# Altium project Prj_uinv-rev-b.PrjPcb
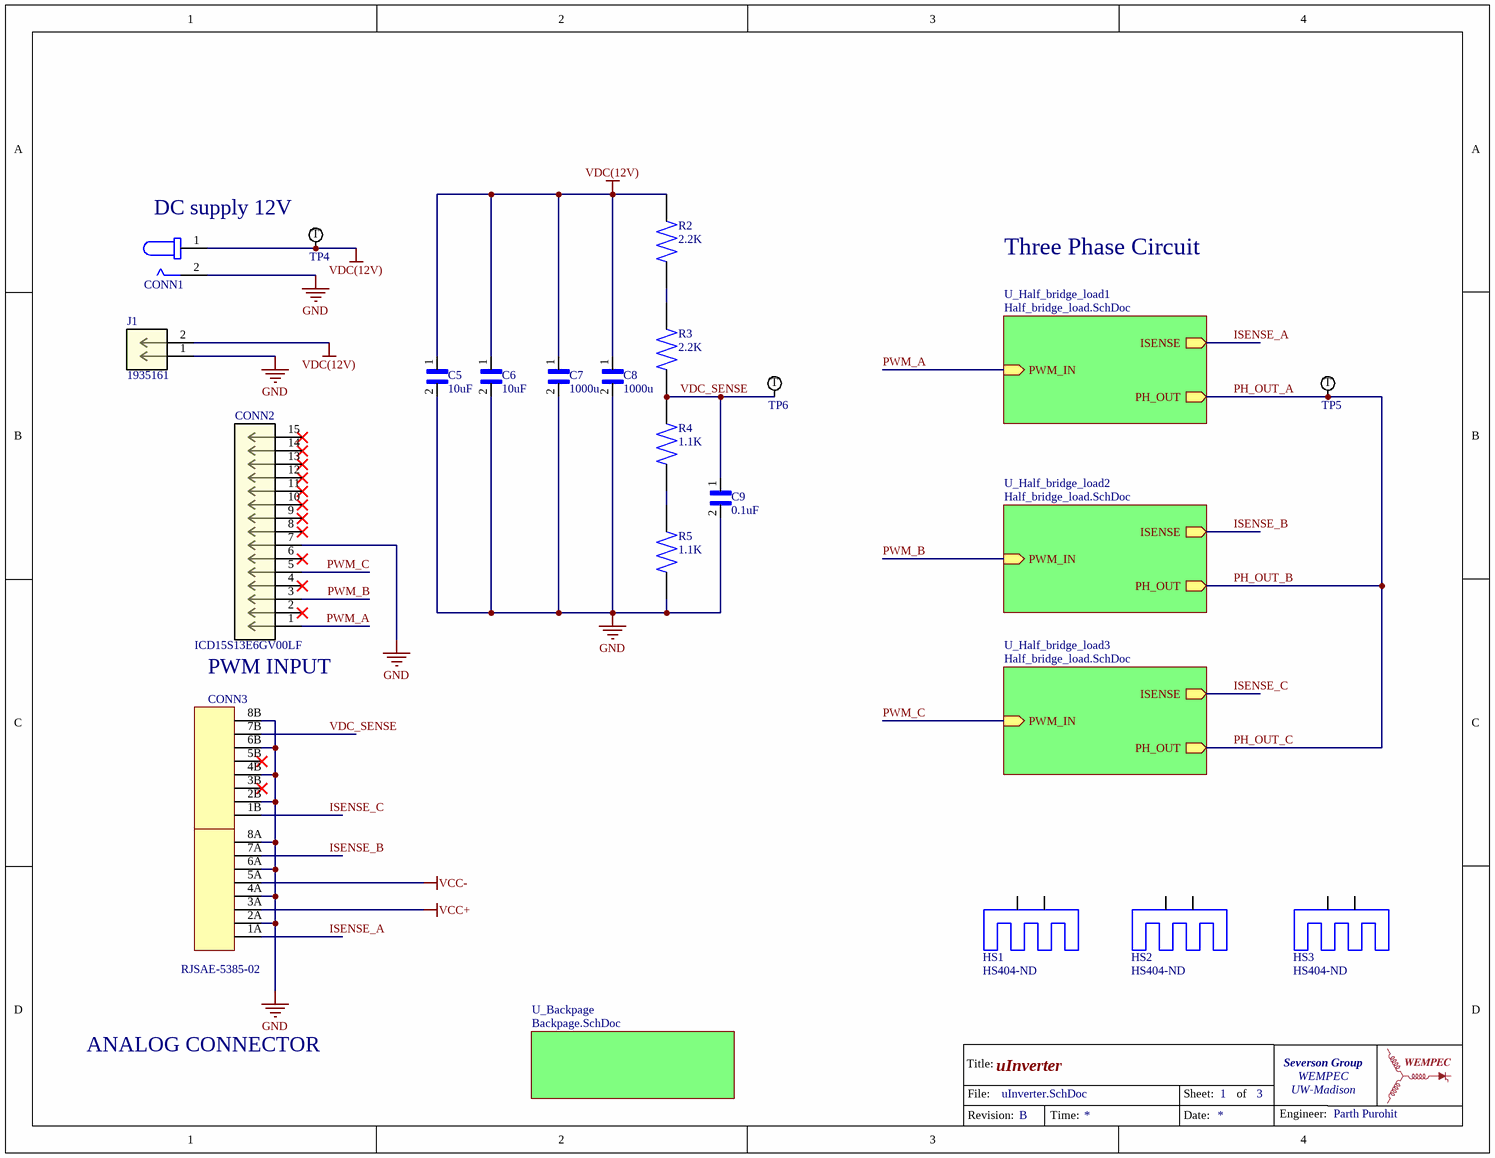
[diagram p0: uInverter.SchDoc]
ProjectGroup: Severson Group; ProjectOrganization: WEMPEC; ProjectRev: B; ProjectUniversity: UW-Madison
3 sheets, 99 parts. Net scope: hierarchical (ports join the sheet entries above them; power ports are global).
Board file: PCB1_uinv_rev_B.PcbDoc
Sheets:
  uInverter.SchDoc
    U_Half_bridge_load1 = Half_bridge_load.SchDoc
    U_Half_bridge_load2 = Half_bridge_load.SchDoc
    U_Half_bridge_load3 = Half_bridge_load.SchDoc
    U_Backpage = Backpage.SchDoc

## Sheet uInverter.SchDoc: uInverter
size Letter; Engineer: Parth Purohit; Revision: B; SheetNumber: 1; SheetTotal: 3

### Parts
C5  10uF  [0805_CAP]
C6  10uF  [0805_CAP]
C7  1000u  [CAP_PAN_12.5X25_PAN]
C8  1000u  [CAP_PAN_12.5X25_PAN]
C9  0.1uF  [0805_CAP]
CONN1  PJ-037AH  [CUI_PJ-037AH]  (value not drawn)
CONN2  ICD15S13E6GV00LF  [ICD15S13E6GV00LF]
CONN3  RJSAE-5385-02  [CONN_RJSAE538502_AMP]
HS1  Supplier Part Number 1: HS404-ND  [530002]  (hidden comment: 529702B02500G)
HS2  Supplier Part Number 1: HS404-ND  [530002]  (hidden comment: 529702B02500G)
HS3  Supplier Part Number 1: HS404-ND  [530002]  (hidden comment: 529702B02500G)
J1  1935161  [PHOENIX_1935161]
R2  2.2K  [0805_RES]
R3  2.2K  [0805_RES]
R4  1.1K  [0805_RES]
R5  1.1K  [0805_RES]
TitleBlockWEMPEC1  TitleBlockWEMPEC  (value not drawn)  (graphical)
TP4  Test Point  [TP_1.6MM]  (value not drawn)
TP5  Test Point  [TP_1.6MM]  (value not drawn)
TP6  Test Point  [TP_1.6MM]  (value not drawn)

### Sub-sheets
U_Backpage = Backpage.SchDoc: no entries
U_Half_bridge_load1 = Half_bridge_load.SchDoc: ISENSE (out), PWM_IN (in), PH_OUT (out)
U_Half_bridge_load2 = Half_bridge_load.SchDoc: ISENSE (out), PWM_IN (in), PH_OUT (out)
U_Half_bridge_load3 = Half_bridge_load.SchDoc: ISENSE (out), PWM_IN (in), PH_OUT (out)

### Nets
GND: C5.2 C6.2 C7.2 C8.2 C9.2 CONN1.2 CONN2.7 CONN3.2A CONN3.2B CONN3.4A CONN3.4B CONN3.6A CONN3.6B CONN3.8A CONN3.8B J1.1 R5.1
VCC+: CONN3.3A
VCC-: CONN3.5A
VDC(12V): C5.1 C6.1 C7.1 C8.1 CONN1.1 J1.2 R2.2 TP4.1
ISENSE_A: CONN3.1A ; sheet U_Half_bridge_load1/ISENSE
ISENSE_B: CONN3.7A ; sheet U_Half_bridge_load2/ISENSE
ISENSE_C: CONN3.1B ; sheet U_Half_bridge_load3/ISENSE
PH_OUT_A: TP5.1 ; sheet U_Half_bridge_load1/PH_OUT, sheet U_Half_bridge_load2/PH_OUT, sheet U_Half_bridge_load3/PH_OUT  [also labelled PH_OUT_B, PH_OUT_C]
PWM_A: CONN2.1 ; sheet U_Half_bridge_load1/PWM_IN
PWM_B: CONN2.3 ; sheet U_Half_bridge_load2/PWM_IN
PWM_C: CONN2.5 ; sheet U_Half_bridge_load3/PWM_IN
VDC_SENSE: C9.1 CONN3.7B R3.1 R4.2 TP6.1
NetR2_1: R2.1 R3.2
NetR4_1: R4.1 R5.2

Not connected (* = marked no-connect by the designer): CONN2 2* 4* 6* 8* 9* 10* 11* 12* 13* 14* 15*; CONN3 3B(79)* 5B(79)*; HS1 P$1(1) P$2(2); HS2 P$1(1) P$2(2); HS3 P$1(1) P$2(2)

### Notes on the sheet
- DC supply 12V
- Three Phase Circuit
- PWM INPUT
- ANALOG CONNECTOR
- (in symbol Test Point 36-5005ND) T
- (in symbol TitleBlockWEMPEC) Title:; File:; Sheet:; of; Engineer:; Revision:; Time:; Date:

### Library data of the parts
C5 C6 = GRM21BR6YA106KE43L: 0805 35 V 10 uF ±10% Tolerance X5R Multilayer Ceramic Capacitor; Manufacturer: Murata; Voltage Rating: 35V; Supplier 1: Digi-Key; Manufacturer Part Number: GRM21BR6YA106KE43L; RoHS: Yes; Category: Ceramic Capacitors; Stock 1: 12398; Pricing 1: 3000=0.12929, 6000=0.12211, 9000=0.11493, 15000=0.11134, 30000=0.10775, 75000=0.10056 (USD); Mount: Surface Mount; Case/Package: 0805; Case Code (Metric): 2012; Case Code (Imperial): 0805; Weight: 0.000335oz; Min Operating Temperature: -55°C; Max Operating Temperature: 85°C; Value: 10uF; Packaging: Tape and Reel; Dielectric: X5R; Tolerance: 10%; Termination: SMD/SMT; Voltage Rating (DC): 35V; Package Quantity: 3000; Length: 0.079inch; Width: 0.049inch; Height: 1.25mm; Thickness: 0.057inch; REACH SVHC: No SVHC; Lead Free: Lead Free; RoHS Compliant: Yes; ComponentLink1URL: http://www.farnell.com/datasheets/2079187.pdf?src-supplier=Farnell; ComponentLink1Description: http://www.farnell.com/datasheets/2079187.pdf?src-supplier=Farnell; ComponentLink2URL: http://www.mouser.com/ds/2/281/c02e-2905.pdf?src-supplier=Mouser; ComponentLink2Description: http://www.mouser.com/ds/2/281/c02e-2905.pdf?src-supplier=Mouser; ComponentLink3URL: http://www.farnell.com/datasheets/2079187.pdf?src-supplier=Element14; ComponentLink3Description: http://www.farnell.com/datasheets/2079187.pdf?src-supplier=Element14; ComponentLink4URL: http://search.murata.co.jp/Ceramy/image/img/A01X/G101/ENG/GRM21BR6YA106KE43-01.pdf?src-supplier=Digi-Key; ComponentLink4Description: http://search.murata.co.jp/Ceramy/image/img/A01X/G101/ENG/GRM21BR6YA106KE43-01.pdf?src-supplier=Digi-Key; ComponentLink5URL: http://search.murata.co.jp/Ceramy/image/img/A01X/partnumbering_e_01.pdf?src-supplier=Digi-Key; ComponentLink5Description: http://search.murata.co.jp/Ceramy/image/img/A01X/partnumbering_e_01.pdf?src-supplier=Digi-Key; ComponentLink6URL: http://www.farnell.com/datasheets/2079187.pdf?src-supplier=Newark; ComponentLink6Description: http://www.farnell.com/datasheets/2079187.pdf?src-supplier=Newark; Supplier Part Number 1: 490-10514-2-ND
C7 C8 = EEU-FM1V102B: Cap Aluminum 1000uF 35V 20% (12.5 X 25mm) Radial 5mm 3190mA 7000 hr 105C Ammo Pack; Manufacturer: Panasonic; Value: 1mF; Ripple Current: 3.19A; Life (Hours): 7000Hour; Impedance: 15mR; Polarity: Polar; Lead Diameter: 0.6mm; Supplier 1: Digi-Key; Manufacturer Part Number: EEU-FM1V102B; RoHS: Yes; Category: Aluminum Electrolytic Capacitors; Stock 1: 691; Pricing 1: 1=1.11000, 10=0.84300, 50=0.70060, 100=0.60330 (USD); Mount: Through Hole; Case/Package: Radial; Min Operating Temperature: -40°C; Max Operating Temperature: 105°C; Tolerance: 20%; Termination: Radial; Voltage Rating: 35V; Packaging: Tape and Reel; Package Quantity: 500; Voltage Rating (DC): 35V; ESR (Equivalent Series Resistance): 15mR; Series: FM; Construction: RADIAL; Diameter: 12mm; Length: 25mm; Height: 25mm; Lead Pitch: 5mm; Height - Seated (Max): 1.063inch; Radiation Hardening: No; Lead Free: Lead Free; RoHS Compliant: Yes; ComponentLink1URL: https://datasheet.ciiva.com/11676/aba0000ce108-11676917.pdf?src-supplier=Avnet; ComponentLink1Description: https://datasheet.ciiva.com/11676/aba0000ce108-11676917.pdf?src-supplier=Avnet; Supplier Part Number 1: P19719CT-ND
C9 = CC0805KRX7R7BB104: Capacitor 0.1uF 16V 0805 SMD X7R; Manufacturer: Yageo; Value: 100nF; Tolerance: 10%; Insulation Resistance: 100GR; Supplier 1: Digi-Key; Manufacturer Part Number: CC0805KRX7R7BB104; RoHS: Yes; Category: Ceramic Capacitors; Stock 1: 1440; Pricing 1: 1=0.12000, 10=0.08400, 50=0.04760, 100=0.03950, 500=0.02768, 1000=0.02291 (USD); Mount: Surface Mount; Case/Package: 0805; Number of Pins: 2; Case Code (Metric): 2012; Case Code (Imperial): 0805; Min Operating Temperature: -55°C; Max Operating Temperature: 125°C; Dielectric: X7R; Voltage Rating: 16V; Voltage Rating (DC): 16V; Packaging: Tape and Reel; Package Quantity: 1; Termination: SMD/SMT; Resistor Type: Ceramic; Voltage: 16V; Series: CC; Length: 2mm; Width: 0.049inch; Height: 0.85mm; Depth: 1.25mm; Thickness: 0.033inch; Radiation Hardening: No; RoHS Compliant: Yes; REACH SVHC: No SVHC; Lead Free: Lead Free; Halogen Free: Halogen Free; ComponentLink1URL: https://datasheet.ciiva.com/11786/0900766b80d84f1d-11786102.pdf?src-supplier=RSComponents; ComponentLink1Description: https://datasheet.ciiva.com/11786/0900766b80d84f1d-11786102.pdf?src-supplier=RSComponents; ComponentLink2URL: https://datasheet.ciiva.com/8034/1784427-8034017.pdf?src-supplier=Element14; ComponentLink2Description: https://datasheet.ciiva.com/8034/1784427-8034017.pdf?src-supplier=Element14; ComponentLink3URL: https://datasheet.ciiva.com/144/mlccorderingcode-144998.pdf?src-supplier=Digi-Key; ComponentLink3Description: https://datasheet.ciiva.com/144/mlccorderingcode-144998.pdf?src-supplier=Digi-Key; ComponentLink4URL: https://datasheet.ciiva.com/144/mlccorderingcode-144999.pdf?src-supplier=Digi-Key; ComponentLink4Description: https://datasheet.ciiva.com/144/mlccorderingcode-144999.pdf?src-supplier=Digi-Key; ComponentLink5URL: https://datasheet.ciiva.com/145/mlccorderingcode-145000.pdf?src-supplier=Digi-Key; ComponentLink5Description: https://datasheet.ciiva.com/145/mlccorderingcode-145000.pdf?src-supplier=Digi-Key; ComponentLink6URL: https://datasheet.ciiva.com/11465/upy-gphc-x7r-6-3v-to-50v-8-11465289.pdf?src-supplier=Avnet; ComponentLink6Description: https://datasheet.ciiva.com/11465/upy-gphc-x7r-6-3v-to-50v-8-11465289.pdf?src-supplier=Avnet; ComponentLink7URL: https://datasheet.ciiva.com/17436/upy-gphc-x7r-6-3v-to-50v-8-17436617.pdf?src-supplier=Avnet+Europe; ComponentLink7Description: https://datasheet.ciiva.com/17436/upy-gphc-x7r-6-3v-to-50v-8-17436617.pdf?src-supplier=Avnet+Europe; ComponentLink8URL: https://datasheet.ciiva.com/8034/1784427-8034015.pdf?src-supplier=Element14; ComponentLink8Description: https://datasheet.ciiva.com/8034/1784427-8034015.pdf?src-supplier=Element14; ComponentLink9URL: https://datasheet.ciiva.com/15189/getdatasheetpartid-314877-15189221.pdf?src-supplier=Verical; ComponentLink9Description: https://datasheet.ciiva.com/15189/getdatasheetpartid-314877-15189221.pdf?src-supplier=Verical; ComponentLink10URL: https://datasheet.ciiva.com/7978/1489800-7978204.pdf?src-supplier=Element14; ComponentLink10Description: https://datasheet.ciiva.com/7978/1489800-7978204.pdf?src-supplier=Element14; Supplier Part Number 1: 311-1142-1-ND
CONN1 = PJ-037AH: CONN PWR JACK 2X5.5MM SOLDER; Manufacturer: CUI; Shielding: Unshielded; Gender: Male; Current Rating: 5A; Number of Conductors: 2; Voltage Rating: 24V; Insulation Resistance: 100MR; Supplier 1: Digi-Key; Manufacturer Part Number: PJ-037AH; RoHS: Yes; Category: Connectors; Stock 1: 11304; Pricing 1: 1=0.71000, 10=0.66600, 25=0.59920, 50=0.53280, 100=0.51060, 250=0.46620, 500=0.44400, 1000=0.36630, 2500=0.33300 (USD); Mount: Through Hole; Color: Black; Contact Material: Copper; Contact Plating: Nickel; Housing Color: Black; Housing Material: Thermoplastic; Min Operating Temperature: -25°C; Max Operating Temperature: 85°C; Connector Type: Jack; Termination: Solder; Package Quantity: 500; Contact Gender: Male; Orientation: Horizontal; Series: -; Flammability Rating: UL94 V-0; Lead Free: Lead Free; RoHS Compliant: Yes; ComponentLink1URL: http://www.mouser.com/ds/2/670/pj-037ah-516064.pdf?src-supplier=Mouser; ComponentLink1Description: http://www.mouser.com/ds/2/670/pj-037ah-516064.pdf?src-supplier=Mouser; ComponentLink2URL: https://www.cui.com/product/resource/digikeypdf/pj-037ah.pdf?src-supplier=Digi-Key; ComponentLink2Description: https://www.cui.com/product/resource/digikeypdf/pj-037ah.pdf?src-supplier=Digi-Key; Supplier Part Number 1: CP-037AH-ND
CONN2 = ICD15S13E6GV00LF: Conn High Density D-Sub SKT 15 POS 2.28mm Solder RA Thru-Hole 15 Terminal 1 Port; Manufacturer: Amphenol FCI; Plating: Bright,Tin,Steel,Chrome; Body Material: Metal,Steel; Number of Terminals/Pins: 15; Mating Cycles: 500; Voltage Rating: 300V; Current Rating: 3A; Gender: Female; Connector Type: D-Sub,Receptacle,Signal; Number of Ports: 1; Supplier 1: Digi-Key; Manufacturer Part Number: ICD15S13E6GV00LF; RoHS: Yes; Category: D-Sub Connectors; Stock 1: 3485; Pricing 1: 1=2.28000, 10=2.06800, 25=1.94120, 50=1.85680, 100=1.77230, 250=1.60352, 500=1.47692, 1000=1.26593, 2500=1.18154 (USD); Mount: Through Hole; Case/Package: Metal; Color: Black; Contact Plating: Gold,Tin,Matte; Contact Material: Copper Alloy; Housing Color: Black; Housing Material: Steel; Min Operating Temperature: -55°C; Max Operating Temperature: 125°C; Packaging: Bulk; Package Quantity: 100; Number of Rows: 3; Max Voltage Rating (AC): 300V; Number of Positions: 15; Termination: Solder; Number of Contacts: 15; Max Supply Voltage (AC): 300V; Orientation: Right Angle; Length: 30.81mm; Width: 12.58mm; Pitch: 2.28mm; Depth: 21.7mm; Radiation Hardening: No; REACH SVHC: No SVHC; Lead Free: Lead Free; Flammability Rating: UL94 V-0; ComponentLink1URL: https://datasheet.ciiva.com/22727/1728476-22727809.pdf?src-supplier=Element14; ComponentLink1Description: https://datasheet.ciiva.com/22727/1728476-22727809.pdf?src-supplier=Element14; ComponentLink2URL: https://datasheet.ciiva.com/652/c-cd-0011-652471.pdf?src-supplier=Digi-Key; ComponentLink2Description: https://datasheet.ciiva.com/652/c-cd-0011-652471.pdf?src-supplier=Digi-Key; ComponentLink3URL: https://datasheet.ciiva.com/8058/1728476-8058812.pdf?src-supplier=Element14; ComponentLink3Description: https://datasheet.ciiva.com/8058/1728476-8058812.pdf?src-supplier=Element14; Supplier Part Number 1: 609-2802-ND
CONN3 = RJSAE-5385-02: CONN MOD JACK 8P8C R/A SHIELDED; Manufacturer: Amphenol Commercial; Number of Contacts: 16; Gender: Female; Current Rating: 1.5A; Voltage Rating: 125V; Number of Ports: 2; Direction: Up and Down; Pitch: 2.54mm; Supplier 1: Digi-Key; Manufacturer Part Number: RJSAE-5385-02; RoHS: Yes; Category: Modular / Ethernet Connectors; Stock 1: 254; Pricing 1: 1=6.67000, 10=6.39000, 25=5.83440, 50=5.55660, 100=5.27880, 250=4.72312, 500=4.44528, 1000=4.01310 (USD); Mount: Through Hole; Color: Black,Green; Contact Plating: Gold; Contact Material: Bronze; Housing Material: Thermoplastic; Min Operating Temperature: -55°C; Max Operating Temperature: 85°C; Termination: Solder; Orientation: Right Angle; Package Quantity: 35; Packaging: Tray; Shielding: Shielded; Number of Rows: 2; Number of Positions Loaded: 16; Connector Type: Jack; Series: RJSAE; Length: 16.51mm; Depth: 28.15mm; Radiation Hardening: No; Lead Free: Lead Free; RoHS Compliant: Yes; ComponentLink1URL: https://datasheet.ciiva.com/26934/getdatasheetpartid-29521-26934348.pdf?src-supplier=Verical; ComponentLink1Description: https://datasheet.ciiva.com/26934/getdatasheetpartid-29521-26934348.pdf?src-supplier=Verical; Supplier Part Number 1: RJSAE-5385-02-ND
HS1-HS3 = 529702B02500G: Heat Sink Passive TO-220 Radial Thru-Hole 2.6C/W Black Anodized; MP: 530002B02500G; MF: Aavid Thermalloy; Shape: Fins,Rectangular; Thermal Resistance @ Forced Air Flow (100 LFM): 2°C/W; Natural Thermal Resistance: 2.6°C/W; Package: None; SnapEDA_Link: https://www.snapeda.com/parts/530002B02500G/Aavid%20Thermalloy/view-part/4792019/?ref=snap; Availability: Unavailable; Value: *; Price: None; Manufacturer: Aavid Thermalloy; Manufacturer Part Number: 529702B02500G; RoHS: Yes; Category: Heat Sinks; Stock 1: 1035; Pricing 1: 1=6.14000, 10=5.97200, 25=5.64040, 50=5.30860, 100=4.97680, 250=4.64500, 500=4.31320, 1000=4.23026 (USD); Mount: Bolt,PC Pin,Solder; Case/Package: Radial; Color: Black; Package Cooled: TO-220; Material: Aluminium,Anodized; Finish: Anodized; Type: Passive; Package Quantity: 200; Series: 5300; Length: 41.91mm; Width: 1.65inch; Height: 63.5mm; Depth: 25.4mm; Height Off Base: 1inch; Radiation Hardening: No; REACH SVHC: Unknown; Lead Free: Lead Free; RoHS Compliant: Yes; ComponentLink1URL: https://datasheet.ciiva.com/15182/getdatasheetpartid-311919-15182633.pdf?src-supplier=Verical; ComponentLink1Description: https://datasheet.ciiva.com/15182/getdatasheetpartid-311919-15182633.pdf?src-supplier=Verical; ComponentLink2URL: https://datasheet.ciiva.com/22641/1699368-22641984.pdf?src-supplier=Element14; ComponentLink2Description: https://datasheet.ciiva.com/22641/1699368-22641984.pdf?src-supplier=Element14; ComponentLink3URL: https://datasheet.ciiva.com/19457/696626-19457620.pdf?src-supplier=Jameco; ComponentLink3Description: https://datasheet.ciiva.com/19457/696626-19457620.pdf?src-supplier=Jameco; ComponentLink4URL: https://datasheet.ciiva.com/6333/aavid-board-level-heatsinks-catalog-6333980.pdf?src-supplier=Digi-Key; ComponentLink4Description: https://datasheet.ciiva.com/6333/aavid-board-level-heatsinks-catalog-6333980.pdf?src-supplier=Digi-Key; ComponentLink5URL: https://datasheet.ciiva.com/14543/70115166-14543413.pdf?src-supplier=Allied+Electronics; ComponentLink5Description: https://datasheet.ciiva.com/14543/70115166-14543413.pdf?src-supplier=Allied+Electronics; Supplier 1: Digi-Key
J1 = 1935161: Conn Terminal Blocks 2 POS 5mm Solder ST Thru-Hole 16A; Manufacturer: Phoenix Contact; Max Supply Voltage: 250V; Current Rating: 17.5A; Number of Poles: 2; Number of Levels: 1; Current: 18A; Voltage: 300V; Voltage Rating (DC): 320V; Connector Type: Screw; Wire Gauge (Max): 26AWG; Wire Gauge (Min): 12AWG; Approvals: UL; Supplier 1: Digi-Key; Manufacturer Part Number: 1935161; RoHS: Yes; Category: Terminal Blocks; Stock 1: 82071; Pricing 1: 1=0.43000, 10=0.41400, 50=0.39600, 100=0.38520, 250=0.36000, 500=0.33120, 1000=0.30600 (USD); Mount: Through Hole; Number of Pins: 2; Color: Green; Weight: 0.067021oz; Material: Nylon; Housing Color: Green; Housing Material: Polyamide; Insulation Material: Nylon; Contact Material: Copper,Tin; Number of Rows: 1; Max Current Rating: 16A; Voltage Rating: 250V; Package Quantity: 250; Packaging: Bulk; Number of Positions: 2; Number of Positions Per Level: 2; Termination: Solder; Number of Contacts: 2; Number of Circuits: 2; Orientation: Straight; Series: COMBICON PT; Number of Ways: 2; Length: 9mm; Width: 14.9mm; Height: 11.3mm; Pitch: 5mm; Depth: 9mm; Wire/Cable Gauge: 26AWG; Radiation Hardening: No; Lead Free: Lead Free; Flammability Rating: UL94 V-0; REACH SVHC: Unknown; RoHS Compliant: Yes; ComponentLink1URL: https://datasheet.ciiva.com/15169/getdatasheetpartid-177903-15169663.pdf?src-supplier=Verical; ComponentLink1Description: https://datasheet.ciiva.com/15169/getdatasheetpartid-177903-15169663.pdf?src-supplier=Verical; ComponentLink2URL: https://datasheet.ciiva.com/16047/1935161-16047247.pdf?src-supplier=Onlinecomponents.com; ComponentLink2Description: https://datasheet.ciiva.com/16047/1935161-16047247.pdf?src-supplier=Onlinecomponents.com; ComponentLink3URL: https://datasheet.ciiva.com/824/combiconcompact5-0mmseries-824222.pdf?src-supplier=Digi-Key; ComponentLink3Description: https://datasheet.ciiva.com/824/combiconcompact5-0mmseries-824222.pdf?src-supplier=Digi-Key; Supplier Part Number 1: 277-1667-ND
R2 R3 = RCS08052K20FKEA: Res Thick Film 0805 2.2K Ohm 1% 0.4W; Manufacturer: Vishay Dale; Value: 2.2kR; Max Power Dissipation: 400mW; Temperature Coefficient: 100ppm/°C; Supplier 1: Digi-Key; Manufacturer Part Number: RCS08052K20FKEA; RoHS: Yes; Category: Chip SMD Resistors; Stock 1: 5528; Pricing 1: 1=0.26000, 10=0.21800, 100=0.08510, 1000=0.03560, 2500=0.03264 (USD); Case/Package: 0805; Case Code (Metric): 2012; Case Code (Imperial): 0805; Min Operating Temperature: -55°C; Max Operating Temperature: 155°C; Packaging: Cut Tape; Resistor Type: Thick Film; Number of Terminations: 2; Tolerance: 1%; Features: Automotive AEC-Q200; Length: 0.079inch; Width: 0.049inch; Height: 0.02inch; ComponentLink1URL: http://www.vishay.com/docs/20065/rcse3.pdf?src-supplier=Digi-Key; ComponentLink1Description: http://www.vishay.com/docs/20065/rcse3.pdf?src-supplier=Digi-Key; Supplier Part Number 1: 541-2841-1-ND
R4 R5 = ESR10EZPF1101: Res Thick Film 0805 1.1K Ohm 1% 0.4W; Manufacturer: Rohm; Value: 1.1kR; Temperature Coefficient: 100ppm/°C; Power Rating: 400mW; Supplier 1: Digi-Key; Manufacturer Part Number: ESR10EZPF1101; RoHS: Yes; Category: Chip SMD Resistors; Stock 1: 6361; Pricing 1: 1=0.18000, 10=0.15300, 100=0.05980, 1000=0.02505, 2500=0.02296 (USD); Case/Package: 0805; Case Code (Metric): 2012; Case Code (Imperial): 0805; Size Code: 0805; Min Operating Temperature: -55°C; Max Operating Temperature: 155°C; Tolerance: 1%; Packaging: Tape and Reel; Resistor Type: Thick Film; Package Quantity: 1; Number of Terminations: 2; Max Power Dissipation: 400mW; Features: Automotive AEC-Q200; Series: ESR; Length: 0.079inch; Width: 0.049inch; Height: 0.026inch; Lead Free: Lead Free; RoHS Compliant: Yes; ComponentLink1URL: https://datasheet.ciiva.com/2470/esr-2470093.pdf?src-supplier=Digi-Key; ComponentLink1Description: https://datasheet.ciiva.com/2470/esr-2470093.pdf?src-supplier=Digi-Key; ComponentLink2URL: https://datasheet.ciiva.com/2470/esr-2470094.pdf?src-supplier=Digi-Key; ComponentLink2Description: https://datasheet.ciiva.com/2470/esr-2470094.pdf?src-supplier=Digi-Key; ComponentLink3URL: https://datasheet.ciiva.com/2470/esr-2470095.pdf?src-supplier=Digi-Key; ComponentLink3Description: https://datasheet.ciiva.com/2470/esr-2470095.pdf?src-supplier=Digi-Key; ComponentLink4URL: https://datasheet.ciiva.com/16212/esr10ezpd-16212063.pdf?src-supplier=Future+Electronics; ComponentLink4Description: https://datasheet.ciiva.com/16212/esr10ezpd-16212063.pdf?src-supplier=Future+Electronics; Supplier Part Number 1: RHM1.10KAECT-ND
TP4-TP6 = Test Point 36-5005ND: Conn Test Point SKT 1 POS ST Thru-Hole 1 Port; Manufacturer: Keystone Electronics; Manufacturer Part Number: 5005; Material - Insulation: No Insulation; Body Material: PBT; Number of Ports: 1; Inside Diameter: 1.78mm; Outside Diameter: 3.18mm; Hole Diameter: 1.6mm; Supplier Part Number: 36-5005-ND; Supplier: Digi-Key; Footprint: *; RoHS: RoHS Compliant; Category: Test and Measurement; Stock 1: 136646; Pricing 1: 1=0.22, 10=0.206, 25=0.1756, 50=0.1536, 100=0.1426, 250=0.12616, 500=0.12068, 1000=0.09874 (USD); Packaging: Cut Tape (CT); Part Status: Active; Type: PC Test Point; Mounting Type: Surface Mount; Color: Natural; Size / Dimension: 0.063" x 0.031" x 0.045" (1.60mm x 0.80mm x 1.15mm); Plating: -; Material - Body: -; ComponentLink1URL: http://www.te.com/commerce/DocumentDelivery/DDEController?Action=srchrtrv&DocNm=1773266&DocType=DS&DocLang=English; ComponentLink1Description: http://www.te.com/commerce/DocumentDelivery/DDEController?Action=srchrtrv&DocNm=1773266&DocType=DS&DocLang=English; Stock 2: 147226; Pricing 2: 1=0.42000, 25=0.34080, 100=0.30150, 250=0.28304, 500=0.25230, 1000=0.19884, 2500=0.18180, 5000=0.17044 (USD); Mount: PCB,Through Hole; Contact Material: Bronze; Contact Plating: Silver,Tin; Material: Nylon,Bronze,Silver; Housing Color: Red; Termination: Solder; Orientation: Straight; Series: THM; Package Quantity: 100; Length: 8.89mm; Height: 0.35inch; Lead Free: Lead Free; REACH SVHC: No SVHC; Flammability Rating: UL94 V-0; RoHS Compliant: Yes; ComponentLink2URL: https://datasheet.ciiva.com/11744/0900766b8009b7c7-11744948.pdf?src-supplier=RSComponents; ComponentLink2Description: https://datasheet.ciiva.com/11744/0900766b8009b7c7-11744948.pdf?src-supplier=RSComponents; ComponentLink3URL: https://datasheet.ciiva.com/2917/m60-2p60-2917633.pdf?src-supplier=Digi-Key; ComponentLink3Description: https://datasheet.ciiva.com/2917/m60-2p60-2917633.pdf?src-supplier=Digi-Key; ComponentLink4URL: https://datasheet.ciiva.com/16508/m60-2p60-16508073.pdf?src-supplier=Future+Electronics; ComponentLink4Description: https://datasheet.ciiva.com/16508/m60-2p60-16508073.pdf?src-supplier=Future+Electronics; ComponentLink5URL: https://datasheet.ciiva.com/1454/1703983-1454828.pdf?src-supplier=Element14; ComponentLink5Description: https://datasheet.ciiva.com/1454/1703983-1454828.pdf?src-supplier=Element14; ComponentLink6URL: https://datasheet.ciiva.com/16883/70182825-16883781.pdf?src-supplier=Allied+Electronics; ComponentLink6Description: https://datasheet.ciiva.com/16883/70182825-16883781.pdf?src-supplier=Allied+Electronics; Supplier 1: Digi-Key; Supplier Part Number 1: 36-5005-ND

## Sheet Half_bridge_load.SchDoc: Half Bridge and Load
size Letter; Engineer: Parth Purohit; Revision: B; SheetNumber: 2; SheetTotal: 3
Used 3 times, as channels U_Half_bridge_load1, U_Half_bridge_load2, U_Half_bridge_load3. Parts and nets are listed once, with the designators drawn on the sheet.
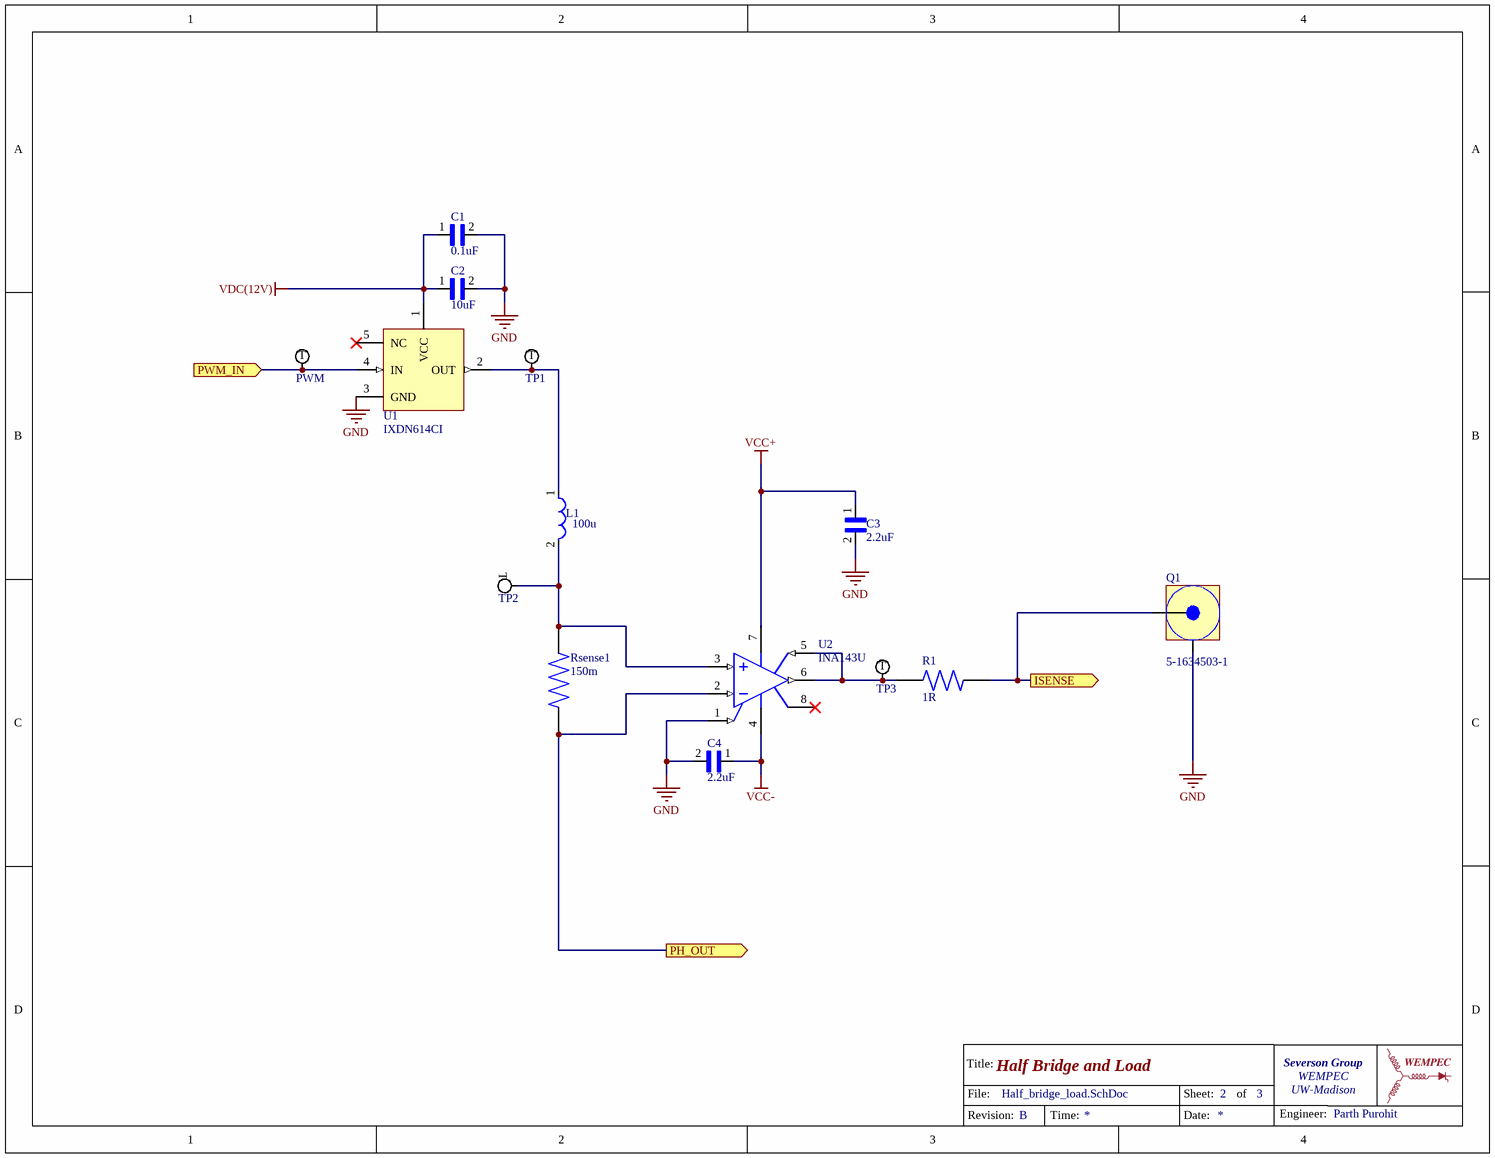
[diagram p1: Half_bridge_load.SchDoc]

### Parts
C1  0.1uF  [0805_CAP]
C2  10uF  [0805_CAP]
C3  2.2uF  [0805_CAP]
C4  2.2uF  [0805_CAP]
L1  100u  [FP-PA4344_104NLT-MFG]
PWM  Test Point  [TP_1.6MM]  (value not drawn)
Q1  5-1634503-1  [5-1634503-1]
R1  1R  [0805_RES]
Rsense1  150m  [RES_15_OHM]
TitleBlockWEMPEC2  TitleBlockWEMPEC  (value not drawn)  (graphical)
TP1  Test Point  [TP_1.6MM]  (value not drawn)
TP2  Test Point  [TP_1.6MM]  (value not drawn)
TP3  Test Point  [TP_1.6MM]  (value not drawn)
U1  IXDN614CI  [IXYS_TO-220-5_IXY]
U2  INA143U  [SOIC127P599X175-8N]

### Ports
ISENSE (out), PH_OUT (out), PWM_IN (in)

### Nets
GND: C1.2 C2.2 C3.2 C4.2 Q1.2 U1.3(GND) U2.1(REF)
VCC+: C3.1 U2.7(V+)
VCC-: C4.1 U2.4(V-)
VDC(12V): C1.1 C2.1 U1.1(VCC)
ISENSE: Q1.1 R1.2 ; port ISENSE
PH_OUT: Rsense1.2 U2.2(IN-) ; port PH_OUT
PWM_IN: PWM.1 U1.4(IN) ; port PWM_IN
NetL1_1: L1.1 TP1.1 U1.2(OUT)
NetL1_2: L1.2 Rsense1.1 TP2.1 U2.3(IN+)
NetR1_1: R1.1 TP3.1 U2.5(SENSE) U2.6(OUTPUT)

Not connected (* = marked no-connect by the designer): U1 5(NC)*; U2 8(NC)*

### Channels
U_Half_bridge_load1: designators end in _U_Half_bridge_load1; ports ISENSE=ISENSE_A PH_OUT=PH_OUT_A PWM_IN=PWM_A
U_Half_bridge_load2: designators end in _U_Half_bridge_load2; ports ISENSE=ISENSE_B PH_OUT=PH_OUT_A PWM_IN=PWM_B
U_Half_bridge_load3: designators end in _U_Half_bridge_load3; ports ISENSE=ISENSE_C PH_OUT=PH_OUT_A PWM_IN=PWM_C

### Notes on the sheet
- (in symbol Test Point 36-5005ND) T
- (in symbol TitleBlockWEMPEC) Title:; File:; Sheet:; of; Engineer:; Revision:; Time:; Date:

### Library data of the parts
C1 = C0805C104K6RACTU: Cap Ceramic 0.1uF 35V X7R 10% SMD 0805; Manufacturer: KEMET; Value: 100nF; Supplier 1: Digi-Key; Manufacturer Part Number: C0805C104K6RACTU; RoHS: Yes; Category: Ceramic Capacitors; Stock 1: 8542; Pricing 1: 1=0.48000, 10=0.33000, 50=0.23100, 100=0.19800, 500=0.14850, 1000=0.12540 (USD); Mount: Surface Mount; Case/Package: 0805; Dielectric Material: Ceramic; Min Operating Temperature: -55°C; Max Operating Temperature: 125°C; Packaging: Tape and Reel; Tolerance: 10%; Dielectric: X7R; Voltage Rating (DC): 35V; Construction: Flat; Length: 2mm; Height: 0.9mm; Depth: 1.25mm; Radiation Hardening: No; RoHS Compliant: Yes; ComponentLink1URL: http://www.kemet.com/kemet/web/homepage/kechome.nsf/weben/C4DA2DA1D1C9D3C3CA2570A50016092D/$file/KEM_C1002_X7R_SMD.pdf?src-supplier=Avnet; ComponentLink1Description: http://www.kemet.com/kemet/web/homepage/kechome.nsf/weben/C4DA2DA1D1C9D3C3CA2570A50016092D/$file/KEM_C1002_X7R_SMD.pdf?src-supplier=Avnet; ComponentLink2URL: https://api.kemet.com/component-edge/download/datasheet/C0805C104K6RAC7800.pdf?src-supplier=Digi-Key; ComponentLink2Description: https://api.kemet.com/component-edge/download/datasheet/C0805C104K6RAC7800.pdf?src-supplier=Digi-Key; Supplier Part Number 1: 399-17618-1-ND
C2 = GRM21BR6YA106KE43L: as C5 on sheet uInverter; Supplier 1: Digi-Key; Manufacturer Part Number: GRM21BR6YA106KE43L; RoHS: Yes; Category: Ceramic Capacitors; Stock 1: 12398; Pricing 1: 3000=0.12929, 6000=0.12211, 9000=0.11493, 15000=0.11134, 30000=0.10775, 75000=0.10056 (USD); Mount: Surface Mount; Case/Package: 0805; Case Code (Metric): 2012; Case Code (Imperial): 0805; Weight: 0.000335oz; Min Operating Temperature: -55°C; Max Operating Temperature: 85°C; Value: 10uF; Packaging: Tape and Reel; Dielectric: X5R; Tolerance: 10%; Termination: SMD/SMT; Voltage Rating (DC): 35V; Package Quantity: 3000; Length: 0.079inch; Width: 0.049inch; Height: 1.25mm; Thickness: 0.057inch; REACH SVHC: No SVHC; Lead Free: Lead Free; RoHS Compliant: Yes; ComponentLink1URL: http://www.farnell.com/datasheets/2079187.pdf?src-supplier=Farnell; ComponentLink1Description: http://www.farnell.com/datasheets/2079187.pdf?src-supplier=Farnell; ComponentLink2URL: http://www.mouser.com/ds/2/281/c02e-2905.pdf?src-supplier=Mouser; ComponentLink2Description: http://www.mouser.com/ds/2/281/c02e-2905.pdf?src-supplier=Mouser; ComponentLink3URL: http://www.farnell.com/datasheets/2079187.pdf?src-supplier=Element14; ComponentLink3Description: http://www.farnell.com/datasheets/2079187.pdf?src-supplier=Element14; ComponentLink4URL: http://search.murata.co.jp/Ceramy/image/img/A01X/G101/ENG/GRM21BR6YA106KE43-01.pdf?src-supplier=Digi-Key; ComponentLink4Description: http://search.murata.co.jp/Ceramy/image/img/A01X/G101/ENG/GRM21BR6YA106KE43-01.pdf?src-supplier=Digi-Key; ComponentLink5URL: http://search.murata.co.jp/Ceramy/image/img/A01X/partnumbering_e_01.pdf?src-supplier=Digi-Key; ComponentLink5Description: http://search.murata.co.jp/Ceramy/image/img/A01X/partnumbering_e_01.pdf?src-supplier=Digi-Key; ComponentLink6URL: http://www.farnell.com/datasheets/2079187.pdf?src-supplier=Newark; ComponentLink6Description: http://www.farnell.com/datasheets/2079187.pdf?src-supplier=Newark; Supplier Part Number 1: 490-10514-2-ND
C3 C4 = C2012X7R1V225K125AB: 2.2 µF ±10% 35V Ceramic Capacitor X7R 0805; Manufacturer: TDK; Supplier 1: Digi-Key; Manufacturer Part Number: C2012X7R1V225K125AB; RoHS: Yes; Category: Ceramic Capacitors; Stock 1: 1992; Pricing 1: 1=0.64000, 10=0.45100, 50=0.34100, 100=0.29700, 500=0.22000, 1000=0.18700 (USD); Mount: Surface Mount; Case/Package: 0805; Case Code (Metric): 2012; Case Code (Imperial): 0805; Weight: 0.000194oz; Dielectric Material: Ceramic; Min Operating Temperature: -55°C; Max Operating Temperature: 125°C; Tolerance: 10%; Packaging: Tape and Reel; Value: 2.2uF; Package Quantity: 1; Voltage Rating: 35V; Dielectric: X7R; Termination: SMD/SMT; Voltage Rating (DC): 35V; Series: C; Construction: Flat; Length: 2mm; Width: 0.049inch; Height: 1.25mm; Thickness: 0.057inch; Depth: 1.25mm; Lead Free: Lead Free; RoHS Compliant: Yes; ComponentLink1URL: https://datasheet.ciiva.com/6286/tdkmlcccaprange-6286902.pdf?src-supplier=Digi-Key; ComponentLink1Description: https://datasheet.ciiva.com/6286/tdkmlcccaprange-6286902.pdf?src-supplier=Digi-Key; ComponentLink2URL: https://datasheet.ciiva.com/6286/tdkmlcccaprange-6286904.pdf?src-supplier=Digi-Key; ComponentLink2Description: https://datasheet.ciiva.com/6286/tdkmlcccaprange-6286904.pdf?src-supplier=Digi-Key; ComponentLink3URL: https://datasheet.ciiva.com/6286/tdkmlcccaprange-6286906.pdf?src-supplier=Digi-Key; ComponentLink3Description: https://datasheet.ciiva.com/6286/tdkmlcccaprange-6286906.pdf?src-supplier=Digi-Key; Supplier Part Number 1: 445-7551-1-ND
L1 = PA4344.104NLT: FIXED IND 100UH 5.3A 118 MOHM; Manufacturer: Pulse; Saturation Current: 6.5A; Shielding: Shielded; DC Resistance (DCR): 118mR; Test Frequency: 100kHz; Supplier 1: Digi-Key; Manufacturer Part Number: PA4344.104NLT; RoHS: Yes; Category: Fixed Inductors; Stock 1: 1739; Pricing 1: 1=3.77000, 10=3.59600, 25=3.42480, 50=2.87700, 100=2.46600 (USD); Mount: Surface Mount; Case/Package: Nonstandard; Min Operating Temperature: -40°C; Max Operating Temperature: 125°C; Packaging: Tape and Reel; Value: 100uH; Current Rating: 5.3A; Length: 0.697inch; Width: 0.677inch; Height - Seated (Max): 0.276inch; Ratings: AEC-Q200; RoHS Compliant: Yes; ComponentLink1URL: http://productfinder.pulseeng.com/products/datasheets/P771.pdf?src-supplier=Digi-Key; ComponentLink1Description: http://productfinder.pulseeng.com/products/datasheets/P771.pdf?src-supplier=Digi-Key; Supplier Part Number 1: 553-3011-1-ND
PWM TP1-TP3 = Test Point 36-5005ND: as TP4 on sheet uInverter; Supplier Part Number: 36-5005-ND; Supplier: Digi-Key; Footprint: *; RoHS: RoHS Compliant; Category: Test and Measurement; Stock 1: 136646; Pricing 1: 1=0.22, 10=0.206, 25=0.1756, 50=0.1536, 100=0.1426, 250=0.12616, 500=0.12068, 1000=0.09874 (USD); Packaging: Cut Tape (CT); Part Status: Active; Type: PC Test Point; Mounting Type: Surface Mount; Color: Natural; Size / Dimension: 0.063" x 0.031" x 0.045" (1.60mm x 0.80mm x 1.15mm); Plating: -; Material - Body: -; ComponentLink1URL: http://www.te.com/commerce/DocumentDelivery/DDEController?Action=srchrtrv&DocNm=1773266&DocType=DS&DocLang=English; ComponentLink1Description: http://www.te.com/commerce/DocumentDelivery/DDEController?Action=srchrtrv&DocNm=1773266&DocType=DS&DocLang=English; Stock 2: 147226; Pricing 2: 1=0.42000, 25=0.34080, 100=0.30150, 250=0.28304, 500=0.25230, 1000=0.19884, 2500=0.18180, 5000=0.17044 (USD); Mount: PCB,Through Hole; Contact Material: Bronze; Contact Plating: Silver,Tin; Material: Nylon,Bronze,Silver; Housing Color: Red; Termination: Solder; Orientation: Straight; Series: THM; Package Quantity: 100; Length: 8.89mm; Height: 0.35inch; Lead Free: Lead Free; REACH SVHC: No SVHC; Flammability Rating: UL94 V-0; RoHS Compliant: Yes; ComponentLink2URL: https://datasheet.ciiva.com/11744/0900766b8009b7c7-11744948.pdf?src-supplier=RSComponents; ComponentLink2Description: https://datasheet.ciiva.com/11744/0900766b8009b7c7-11744948.pdf?src-supplier=RSComponents; ComponentLink3URL: https://datasheet.ciiva.com/2917/m60-2p60-2917633.pdf?src-supplier=Digi-Key; ComponentLink3Description: https://datasheet.ciiva.com/2917/m60-2p60-2917633.pdf?src-supplier=Digi-Key; ComponentLink4URL: https://datasheet.ciiva.com/16508/m60-2p60-16508073.pdf?src-supplier=Future+Electronics; ComponentLink4Description: https://datasheet.ciiva.com/16508/m60-2p60-16508073.pdf?src-supplier=Future+Electronics; ComponentLink5URL: https://datasheet.ciiva.com/1454/1703983-1454828.pdf?src-supplier=Element14; ComponentLink5Description: https://datasheet.ciiva.com/1454/1703983-1454828.pdf?src-supplier=Element14; ComponentLink6URL: https://datasheet.ciiva.com/16883/70182825-16883781.pdf?src-supplier=Allied+Electronics; ComponentLink6Description: https://datasheet.ciiva.com/16883/70182825-16883781.pdf?src-supplier=Allied+Electronics; Supplier 1: Digi-Key; Supplier Part Number 1: 36-5005-ND
Q1 = 5-1634503-1: CONN BNC JACK STR 50 OHM PCB; Manufacturer: TE Connectivity AMP Connectors; Supplier 1: Digi-Key; Supplier Part Number 1: A97581-ND; Manufacturer Part Number: 5-1634503-1
R1 = CRCW08051R00FKEA: Res Thick Film 0805 1 Ohm 1% 1/8W; Manufacturer: Vishay Dale; Temperature Coefficient: 100ppm/°C; Max Power Dissipation: 125mW; Voltage Rating: 150V; Supplier 1: Digi-Key; Manufacturer Part Number: CRCW08051R00FKEA; RoHS: Yes; Category: Chip SMD Resistors; Pricing 1: 1=0.10000, 10=0.08500, 100=0.03280, 1000=0.01442, 2500=0.01246 (USD); Mount: Surface Mount; Case/Package: 0805; Number of Pins: 2; Case Code (Metric): 2012; Case Code (Imperial): 0805; Weight: 0.000194oz; Contact Plating: Tin; Size Code: 0805; Min Operating Temperature: -55°C; Max Operating Temperature: 155°C; Packaging: Tape and Reel; Value: 1R; Tolerance: 1%; Resistor Type: Thick Film; Number of Terminations: 2; Power Rating: 125mW; Package Quantity: 10; Termination: SMD/SMT; Features: Automotive AEC-Q200; Series: CRCW; Resistance Tolerance: 1%; Construction: Rectangular; Length: 2mm; Width: 0.049inch; Height: 0.02inch; Depth: 1.25mm; Radiation Hardening: No; RoHS Compliant: Yes; REACH SVHC: Unknown; Military Standard: Not; ComponentLink1URL: https://datasheet.ciiva.com/7725/dcrcwe3-7725851.pdf?src-supplier=Element14; ComponentLink1Description: https://datasheet.ciiva.com/7725/dcrcwe3-7725851.pdf?src-supplier=Element14; ComponentLink2URL: https://datasheet.ciiva.com/28621/1747939-28621438.pdf?src-supplier=Element14; ComponentLink2Description: https://datasheet.ciiva.com/28621/1747939-28621438.pdf?src-supplier=Element14; ComponentLink3URL: https://datasheet.ciiva.com/2467/dcrcwe3-2467480.pdf?src-supplier=Digi-Key; ComponentLink3Description: https://datasheet.ciiva.com/2467/dcrcwe3-2467480.pdf?src-supplier=Digi-Key; ComponentLink4URL: https://datasheet.ciiva.com/2467/dcrcwe3-2467481.pdf?src-supplier=Digi-Key; ComponentLink4Description: https://datasheet.ciiva.com/2467/dcrcwe3-2467481.pdf?src-supplier=Digi-Key; ComponentLink5URL: https://datasheet.ciiva.com/2467/dcrcwe3-2467479.pdf?src-supplier=Digi-Key; ComponentLink5Description: https://datasheet.ciiva.com/2467/dcrcwe3-2467479.pdf?src-supplier=Digi-Key; ComponentLink6URL: https://datasheet.ciiva.com/16767/70201119-16767273.pdf?src-supplier=Allied+Electronics; ComponentLink6Description: https://datasheet.ciiva.com/16767/70201119-16767273.pdf?src-supplier=Allied+Electronics; ComponentLink7URL: https://datasheet.ciiva.com/5549/dcrcwe3-109170-5549807.pdf?src-supplier=Mouser; ComponentLink7Description: https://datasheet.ciiva.com/5549/dcrcwe3-109170-5549807.pdf?src-supplier=Mouser; ComponentLink8URL: https://datasheet.ciiva.com/16286/dcrcwe3-16286250.pdf?src-supplier=Future+Electronics; ComponentLink8Description: https://datasheet.ciiva.com/16286/dcrcwe3-16286250.pdf?src-supplier=Future+Electronics; ComponentLink9URL: https://datasheet.ciiva.com/17204/dcrcwe3-17204262.pdf?src-supplier=Avnet+Europe; ComponentLink9Description: https://datasheet.ciiva.com/17204/dcrcwe3-17204262.pdf?src-supplier=Avnet+Europe; Supplier Part Number 1: 541-1.00CCCT-ND
Rsense1 = 15FR150E: Resistor; Wirewound; Res 0.15 Ohms; Pwr-Rtg 5 W; Tol 1%; Axial; Silicone; Cur-Sense; Manufacturer: Ohmite; Value: 150mR; Power Rating: 5W; Voltage Rating: 100mV; Temperature Coefficient: 50ppm/°C; Voltage Rating (DC): 1kV; Lead Diameter: 0.05mm; Lead Length: 39.7mm; Body Diameter: 8.4mm; Body Length: 23.8mm; Supplier 1: Digi-Key; Manufacturer Part Number: 15FR150E; RoHS: Yes; Category: Through-Hole Resistors; Stock 1: 1147; Pricing 1: 1=3.11000, 10=2.77800, 25=2.61080, 50=2.38860, 100=2.05540, 250=1.77760, 500=1.61096, 1000=1.41652, 5000=1.36653 (USD); Mount: Through Hole; Case/Package: Axial; Number of Pins: 2; Min Operating Temperature: -55°C; Max Operating Temperature: 275°C; Tolerance: 1%; Package Quantity: 10; Packaging: Bulk; Termination: Axial; Resistor Type: Wirewound; Number of Terminations: 2; Max Power Dissipation: 5W; Series: 10; Resistance Tolerance: 1%; Diameter: 8.4mm; Length: 23.8mm; Lead Free: Lead Free; ComponentLink1URL: https://datasheet.ciiva.com/2716/res-10-2716526.pdf?src-supplier=Digi-Key; ComponentLink1Description: https://datasheet.ciiva.com/2716/res-10-2716526.pdf?src-supplier=Digi-Key; ComponentLink2URL: https://datasheet.ciiva.com/16771/70022566-16771081.pdf?src-supplier=Allied+Electronics; ComponentLink2Description: https://datasheet.ciiva.com/16771/70022566-16771081.pdf?src-supplier=Allied+Electronics; ComponentLink3URL: https://datasheet.ciiva.com/1131/66208-1131710.pdf?src-supplier=Element14; ComponentLink3Description: https://datasheet.ciiva.com/1131/66208-1131710.pdf?src-supplier=Element14; Supplier Part Number 1: 15FR150E-ND
U1 = IXDN614CI: 14-Ampere Low-Side Ultrafast MOSFET Driver 5-Lead TO-220; Manufacturer: IXYS; Number of Outputs: 1; Max Output Current: 14A; Max Supply Voltage: 35V; Rise Time: 35ns; Propagation Delay: 70ns; Min Supply Voltage: 4.5V; Fall Time: 25ns; Output Impedance: 1.5R; Supplier 1: Digi-Key; Manufacturer Part Number: IXDN614CI; RoHS: Yes; Category: Gate Drivers; Stock 1: 879; Pricing 1: 1=5.45000, 10=4.89400, 25=4.62640, 100=4.00960, 250=3.80396, 500=3.41328, 1000=2.90970 (USD); Mount: Through Hole; Case/Package: TO-220-5; Number of Pins: 5; Min Operating Temperature: -40°C; Max Operating Temperature: 125°C; Package Quantity: 50; Packaging: Rail/Tube; Number of Drivers: 1; Series: -; Lead Free: Lead Free; RoHS Compliant: Yes; ComponentLink1URL: https://datasheet.ciiva.com/6611/ixd-614-6611632.pdf?src-supplier=Digi-Key; ComponentLink1Description: https://datasheet.ciiva.com/6611/ixd-614-6611632.pdf?src-supplier=Digi-Key; ComponentLink2URL: https://datasheet.ciiva.com/16352/ixd-614-r00h-16352558.pdf?src-supplier=Future+Electronics; ComponentLink2Description: https://datasheet.ciiva.com/16352/ixd-614-r00h-16352558.pdf?src-supplier=Future+Electronics; Supplier Part Number 1: IXDN614CI-ND
U2 = INA143U: SP Amp Difference Amplifier Single ±18V/36V 8-Pin SOIC Tube; Manufacturer: Texas Instruments; Dual Supply Voltage: 15V; Min Dual Supply Voltage: 2.25V; Max Dual Supply Voltage: 18V; Bandwidth: 150kHz; Nominal Supply Current: 950uA; Common Mode Rejection Ratio: 86dB; Number of Channels: 1; Slew Rate: 5V/µs; Max Supply Voltage: 36V; Min Supply Voltage: 4.5V; Input Offset Voltage (Vos): 100uV; Voltage Gain: 20dB; Input Resistance: 55kR; Output Current per Channel: 32mA; Settling Time: 6us; Supplier 1: Digi-Key; Manufacturer Part Number: INA143U; RoHS: Yes; Category: Amplifiers - Op Amps, Buffer, Instrumentation; Stock 1: 417; Pricing 1: 1=4.01000, 10=3.60000, 25=3.40320, 100=2.79830, 250=2.51096, 500=2.42020, 1000=2.01178, 2500=1.99780 (USD); Case/Package: D; Number of Pins: 8; Weight: 0.002677oz; Min Operating Temperature: -40°C; Max Operating Temperature: 85°C; Package Quantity: 75; Packaging: Rail/Tube; Number of Circuits: 1; Number of Elements: 1; Quiescent Current: 950uA; Gain Bandwidth Product: 150kHz; -3db Bandwidth: 150kHz; Operating Supply Current: 950uA; Max Input Voltage: 36V; Min Input Voltage: 2.25V; Number of Amplifiers: 1; Length: 4.9mm; Width: 3.91mm; Height: 1.58mm; Radiation Hardening: No; Lead Free: Lead Free; REACH SVHC: No SVHC; ComponentLink1URL: https://datasheet.ciiva.com/19474/1341122-19474592.pdf?src-supplier=Jameco; ComponentLink1Description: https://datasheet.ciiva.com/19474/1341122-19474592.pdf?src-supplier=Jameco; ComponentLink2URL: https://datasheet.ciiva.com/15128/getdatasheetpartid-49975-15128159.pdf?src-supplier=Verical; ComponentLink2Description: https://datasheet.ciiva.com/15128/getdatasheetpartid-49975-15128159.pdf?src-supplier=Verical; ComponentLink3URL: https://datasheet.ciiva.com/1799/ina143-1799971.pdf?src-supplier=Digi-Key; ComponentLink3Description: https://datasheet.ciiva.com/1799/ina143-1799971.pdf?src-supplier=Digi-Key; ComponentLink4URL: https://datasheet.ciiva.com/2976/ina2143-2976117.pdf?src-supplier=Avnet; ComponentLink4Description: https://datasheet.ciiva.com/2976/ina2143-2976117.pdf?src-supplier=Avnet; ComponentLink5URL: https://datasheet.ciiva.com/26191/sbos116-26191078.pdf?src-supplier=Avnet+Europe; ComponentLink5Description: https://datasheet.ciiva.com/26191/sbos116-26191078.pdf?src-supplier=Avnet+Europe; ComponentLink6URL: https://datasheet.ciiva.com/1485/693952-1485228.pdf?src-supplier=Element14; ComponentLink6Description: https://datasheet.ciiva.com/1485/693952-1485228.pdf?src-supplier=Element14; ComponentLink7URL: https://datasheet.ciiva.com/48707/001010602-da-01-en-ic-opamp-diff-150khz-ina143u-soic-8-tid-48707338.pdf?src-supplier=Conrad; ComponentLink7Description: https://datasheet.ciiva.com/48707/001010602-da-01-en-ic-opamp-diff-150khz-ina143u-soic-8-tid-48707338.pdf?src-supplier=Conrad; Supplier Part Number 1: INA143U-ND

## Sheet Backpage.SchDoc: uInverter Backpage
size Letter; Engineer: Parth Purohit; Revision: B; SheetNumber: 3; SheetTotal: 3
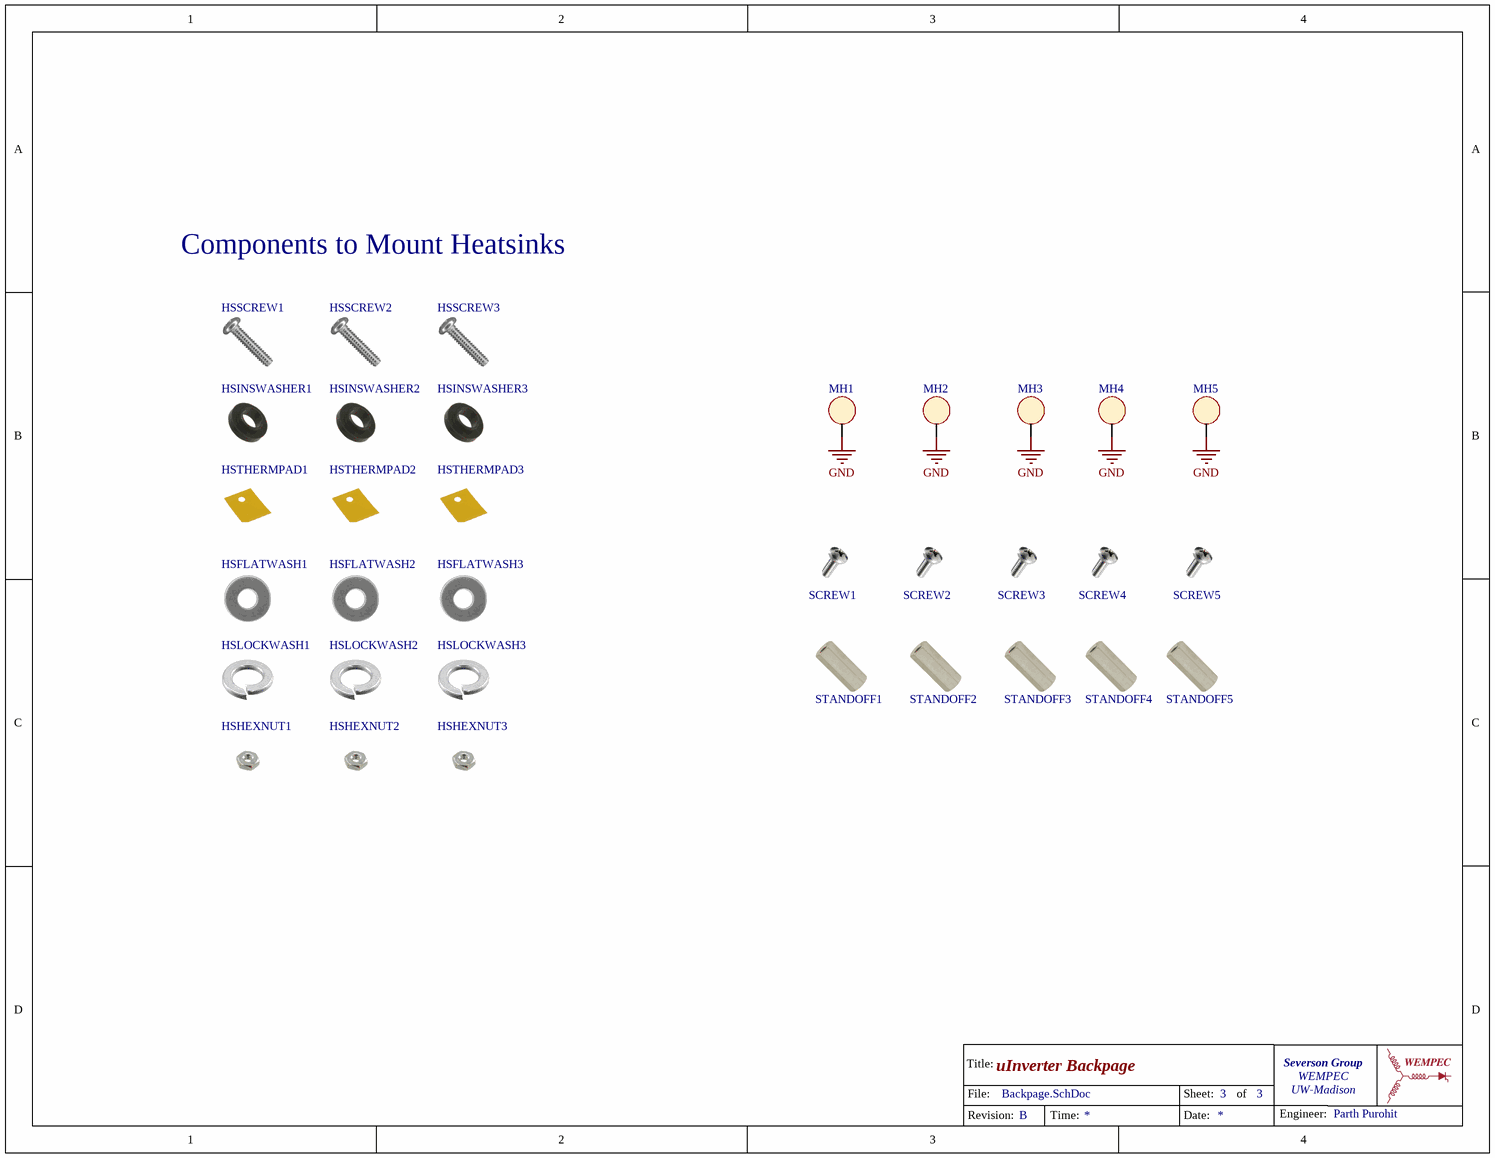
[diagram p2: Backpage.SchDoc]

### Parts
HSFLATWASH1  FWSS 004  (value not drawn)
HSFLATWASH2  FWSS 004  (value not drawn)
HSFLATWASH3  FWSS 004  (value not drawn)
HSHEXNUT1  HNZ 440  (value not drawn)
HSHEXNUT2  HNZ 440  (value not drawn)
HSHEXNUT3  HNZ 440  (value not drawn)
HSINSWASHER1  7721-7PPSG  (value not drawn)
HSINSWASHER2  7721-7PPSG  (value not drawn)
HSINSWASHER3  7721-7PPSG  (value not drawn)
HSLOCKWASH1  4693  (value not drawn)
HSLOCKWASH2  4693  (value not drawn)
HSLOCKWASH3  4693  (value not drawn)
HSSCREW1  PMSSS4400050PH  (value not drawn)
HSSCREW2  PMSSS4400050PH  (value not drawn)
HSSCREW3  PMSSS4400050PH  (value not drawn)
HSTHERMPAD1  43-77-9G  (value not drawn)
HSTHERMPAD2  43-77-9G  (value not drawn)
HSTHERMPAD3  43-77-9G  (value not drawn)
MH1  MOUNT_HOLE  [MOUNTING_HOLE]  (value not drawn)  (no BOM)
MH2  MOUNT_HOLE  [MOUNTING_HOLE]  (value not drawn)  (no BOM)
MH3  MOUNT_HOLE  [MOUNTING_HOLE]  (value not drawn)  (no BOM)
MH4  MOUNT_HOLE  [MOUNTING_HOLE]  (value not drawn)  (no BOM)
MH5  MOUNT_HOLE  [MOUNTING_HOLE]  (value not drawn)  (no BOM)
SCREW1  Screw-4-40  (value not drawn)
SCREW2  Screw-4-40  (value not drawn)
SCREW3  Screw-4-40  (value not drawn)
SCREW4  Screw-4-40  (value not drawn)
SCREW5  Screw-4-40  (value not drawn)
STANDOFF1  Standoff-4-40  (value not drawn)
STANDOFF2  Standoff-4-40  (value not drawn)
STANDOFF3  Standoff-4-40  (value not drawn)
STANDOFF4  Standoff-4-40  (value not drawn)
STANDOFF5  Standoff-4-40  (value not drawn)
TitleBlockWEMPEC3  TitleBlockWEMPEC  (value not drawn)  (graphical)

### Nets
GND: MH1.1 MH2.1 MH3.1 MH4.1 MH5.1

### Notes on the sheet
- Components to Mount Heatsinks
- (in symbol TitleBlockWEMPEC) Title:; File:; Sheet:; of; Engineer:; Revision:; Time:; Date:

### Library data of the parts
HSFLATWASH1-HSFLATWASH3 = FWSS 004: WASHER FLAT #4 STAINLESS STEEL; Manufacturer: B&F Fastener Supply; Supplier Part Number 1: H734-ND; Supplier 1: Digi-Key; Manufacturer Part Number: FWSS 004
HSHEXNUT1-HSHEXNUT3 = HNZ 440: HEX NUT 1/4in 4-40; Manufacturer: B&F Fastener Supply; Supplier Part Number 1: H216-ND; Supplier 1: Digi-Key; Manufacturer Part Number: HNZ 440
HSINSWASHER1-HSINSWASHER3 = 7721-7PPSG: WASHER SHOULDER #4 POLY SULFIDE; Manufacturer: Boyd Laconia, LLC; Supplier Part Number 1: HS418-ND; Supplier 1: Digi-Key; Manufacturer Part Number: 7721-7PPSG
HSLOCKWASH1-HSLOCKWASH3 = 4693: WASHER SPLIT LOCK #4 STEEL; Manufacturer: Keystone Electronics; Supplier Part Number 1: 36-4693-ND; Supplier 1: DIgi-Key; Manufacturer Part Number: 4693
HSSCREW1-HSSCREW3 = PMSSS4400050PH: MACHINE SCREW PAN PHILLIPS 4-40; Manufacturer: B&F Fastener Supply; Supplier Part Number 1: H705-ND; Supplier 1: Digi-Key; Manufacturer Part Number: PMSSS 440 0050 PH
HSTHERMPAD1-HSTHERMPAD3 = 43-77-9G: THERM PAD 18.42MMX13.21MM AMBER; Manufacturer: Boyd Laconia, LLC; Supplier Part Number 1: 43-77-9G-ND; Supplier 1: Digi-Key; Manufacturer Part number: 43-77-9G
MH1-MH5 = MOUNT_HOLE: MOUNTING HOLE
SCREW1-SCREW5 = Screw-4-40: MACH SCREW PAN PHILLIPS #4-40; Manufacturer Part Number: 9900; Manufacturer: Keystone Electronics; Supplier 1: Digi-Key; Supplier Part Number 1: 36-9900-ND
STANDOFF1-STANDOFF5 = Standoff-4-40: HEX STANDOFF #4-40 BRASS 1/2"; Manufacturer Part Number: 1656; Manufacturer: Keystone Electronics; Supplier 1: Digi-Key; Supplier Part Number 1: 36-1656-ND

## Nets that join several sheets
GND: uInverter (17 pins), U_Half_bridge_load1 (7 pins), U_Half_bridge_load2 (7 pins), U_Half_bridge_load3 (7 pins), Backpage (5 pins)
VCC+: uInverter (CONN3.3A), U_Half_bridge_load1 (C3_U_Half_bridge_load1.1 U2_U_Half_bridge_load1.7), U_Half_bridge_load2 (C3_U_Half_bridge_load2.1 U2_U_Half_bridge_load2.7), U_Half_bridge_load3 (C3_U_Half_bridge_load3.1 U2_U_Half_bridge_load3.7)
VCC-: uInverter (CONN3.5A), U_Half_bridge_load1 (C4_U_Half_bridge_load1.1 U2_U_Half_bridge_load1.4), U_Half_bridge_load2 (C4_U_Half_bridge_load2.1 U2_U_Half_bridge_load2.4), U_Half_bridge_load3 (C4_U_Half_bridge_load3.1 U2_U_Half_bridge_load3.4)
VDC(12V): uInverter (8 pins), U_Half_bridge_load1 (C1_U_Half_bridge_load1.1 C2_U_Half_bridge_load1.1 U1_U_Half_bridge_load1.1), U_Half_bridge_load2 (C1_U_Half_bridge_load2.1 C2_U_Half_bridge_load2.1 U1_U_Half_bridge_load2.1), U_Half_bridge_load3 (C1_U_Half_bridge_load3.1 C2_U_Half_bridge_load3.1 U1_U_Half_bridge_load3.1)
ISENSE_A: uInverter (CONN3.1A), U_Half_bridge_load1 (Q1_U_Half_bridge_load1.1 R1_U_Half_bridge_load1.2)
ISENSE_B: uInverter (CONN3.7A), U_Half_bridge_load2 (Q1_U_Half_bridge_load2.1 R1_U_Half_bridge_load2.2)
ISENSE_C: uInverter (CONN3.1B), U_Half_bridge_load3 (Q1_U_Half_bridge_load3.1 R1_U_Half_bridge_load3.2)
PH_OUT_A: uInverter (TP5.1), U_Half_bridge_load1 (Rsense1_U_Half_bridge_load1.2 U2_U_Half_bridge_load1.2), U_Half_bridge_load2 (Rsense1_U_Half_bridge_load2.2 U2_U_Half_bridge_load2.2), U_Half_bridge_load3 (Rsense1_U_Half_bridge_load3.2 U2_U_Half_bridge_load3.2)
PWM_A: uInverter (CONN2.1), U_Half_bridge_load1 (PWM_U_Half_bridge_load1.1 U1_U_Half_bridge_load1.4)
PWM_B: uInverter (CONN2.3), U_Half_bridge_load2 (PWM_U_Half_bridge_load2.1 U1_U_Half_bridge_load2.4)
PWM_C: uInverter (CONN2.5), U_Half_bridge_load3 (PWM_U_Half_bridge_load3.1 U1_U_Half_bridge_load3.4)